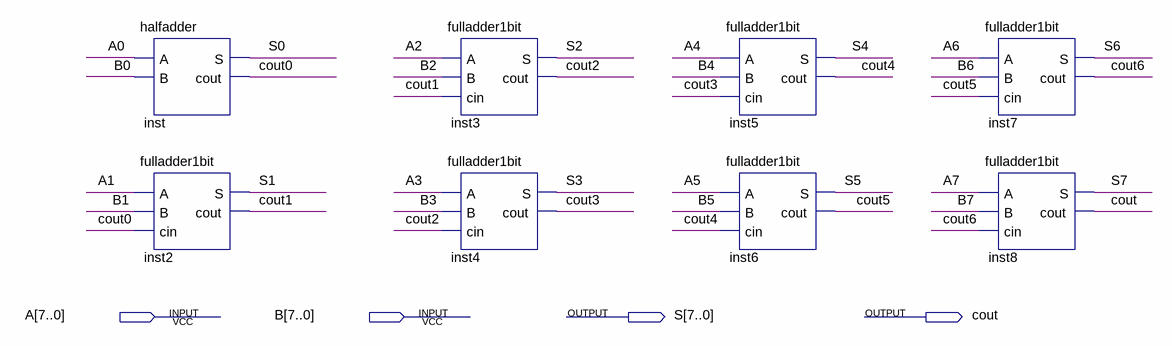
[diagram p0: schematic sheet]
// Quartus schematic fulladder8bits.bdf as structural Verilog: 8 symbols, 4 pins
module fulladder8bits (
  input  [7:0] A,
  input  [7:0] B,
  output [7:0] S,
  output cout
);

  wire cout0, cout1, cout2, cout3, cout4, cout5, cout6;

  halfadder inst (.A(A[0]), .B(B[0]), .S(S[0]), .cout(cout0));
  fulladder1bit inst2 (.A(A[1]), .B(B[1]), .cin(cout0), .S(S[1]), .cout(cout1));
  fulladder1bit inst3 (.A(A[2]), .B(B[2]), .cin(cout1), .S(S[2]), .cout(cout2));
  fulladder1bit inst4 (.A(A[3]), .B(B[3]), .cin(cout2), .S(S[3]), .cout(cout3));
  fulladder1bit inst5 (.A(A[4]), .B(B[4]), .cin(cout3), .S(S[4]), .cout(cout4));
  fulladder1bit inst6 (.A(A[5]), .B(B[5]), .cin(cout4), .S(S[5]), .cout(cout5));
  fulladder1bit inst7 (.A(A[6]), .B(B[6]), .cin(cout5), .S(S[6]), .cout(cout6));
  fulladder1bit inst8 (.A(A[7]), .B(B[7]), .cin(cout6), .S(S[7]), .cout(cout));
endmodule
